# EAGLE design elric20-01A (EAGLE 9.5.2)
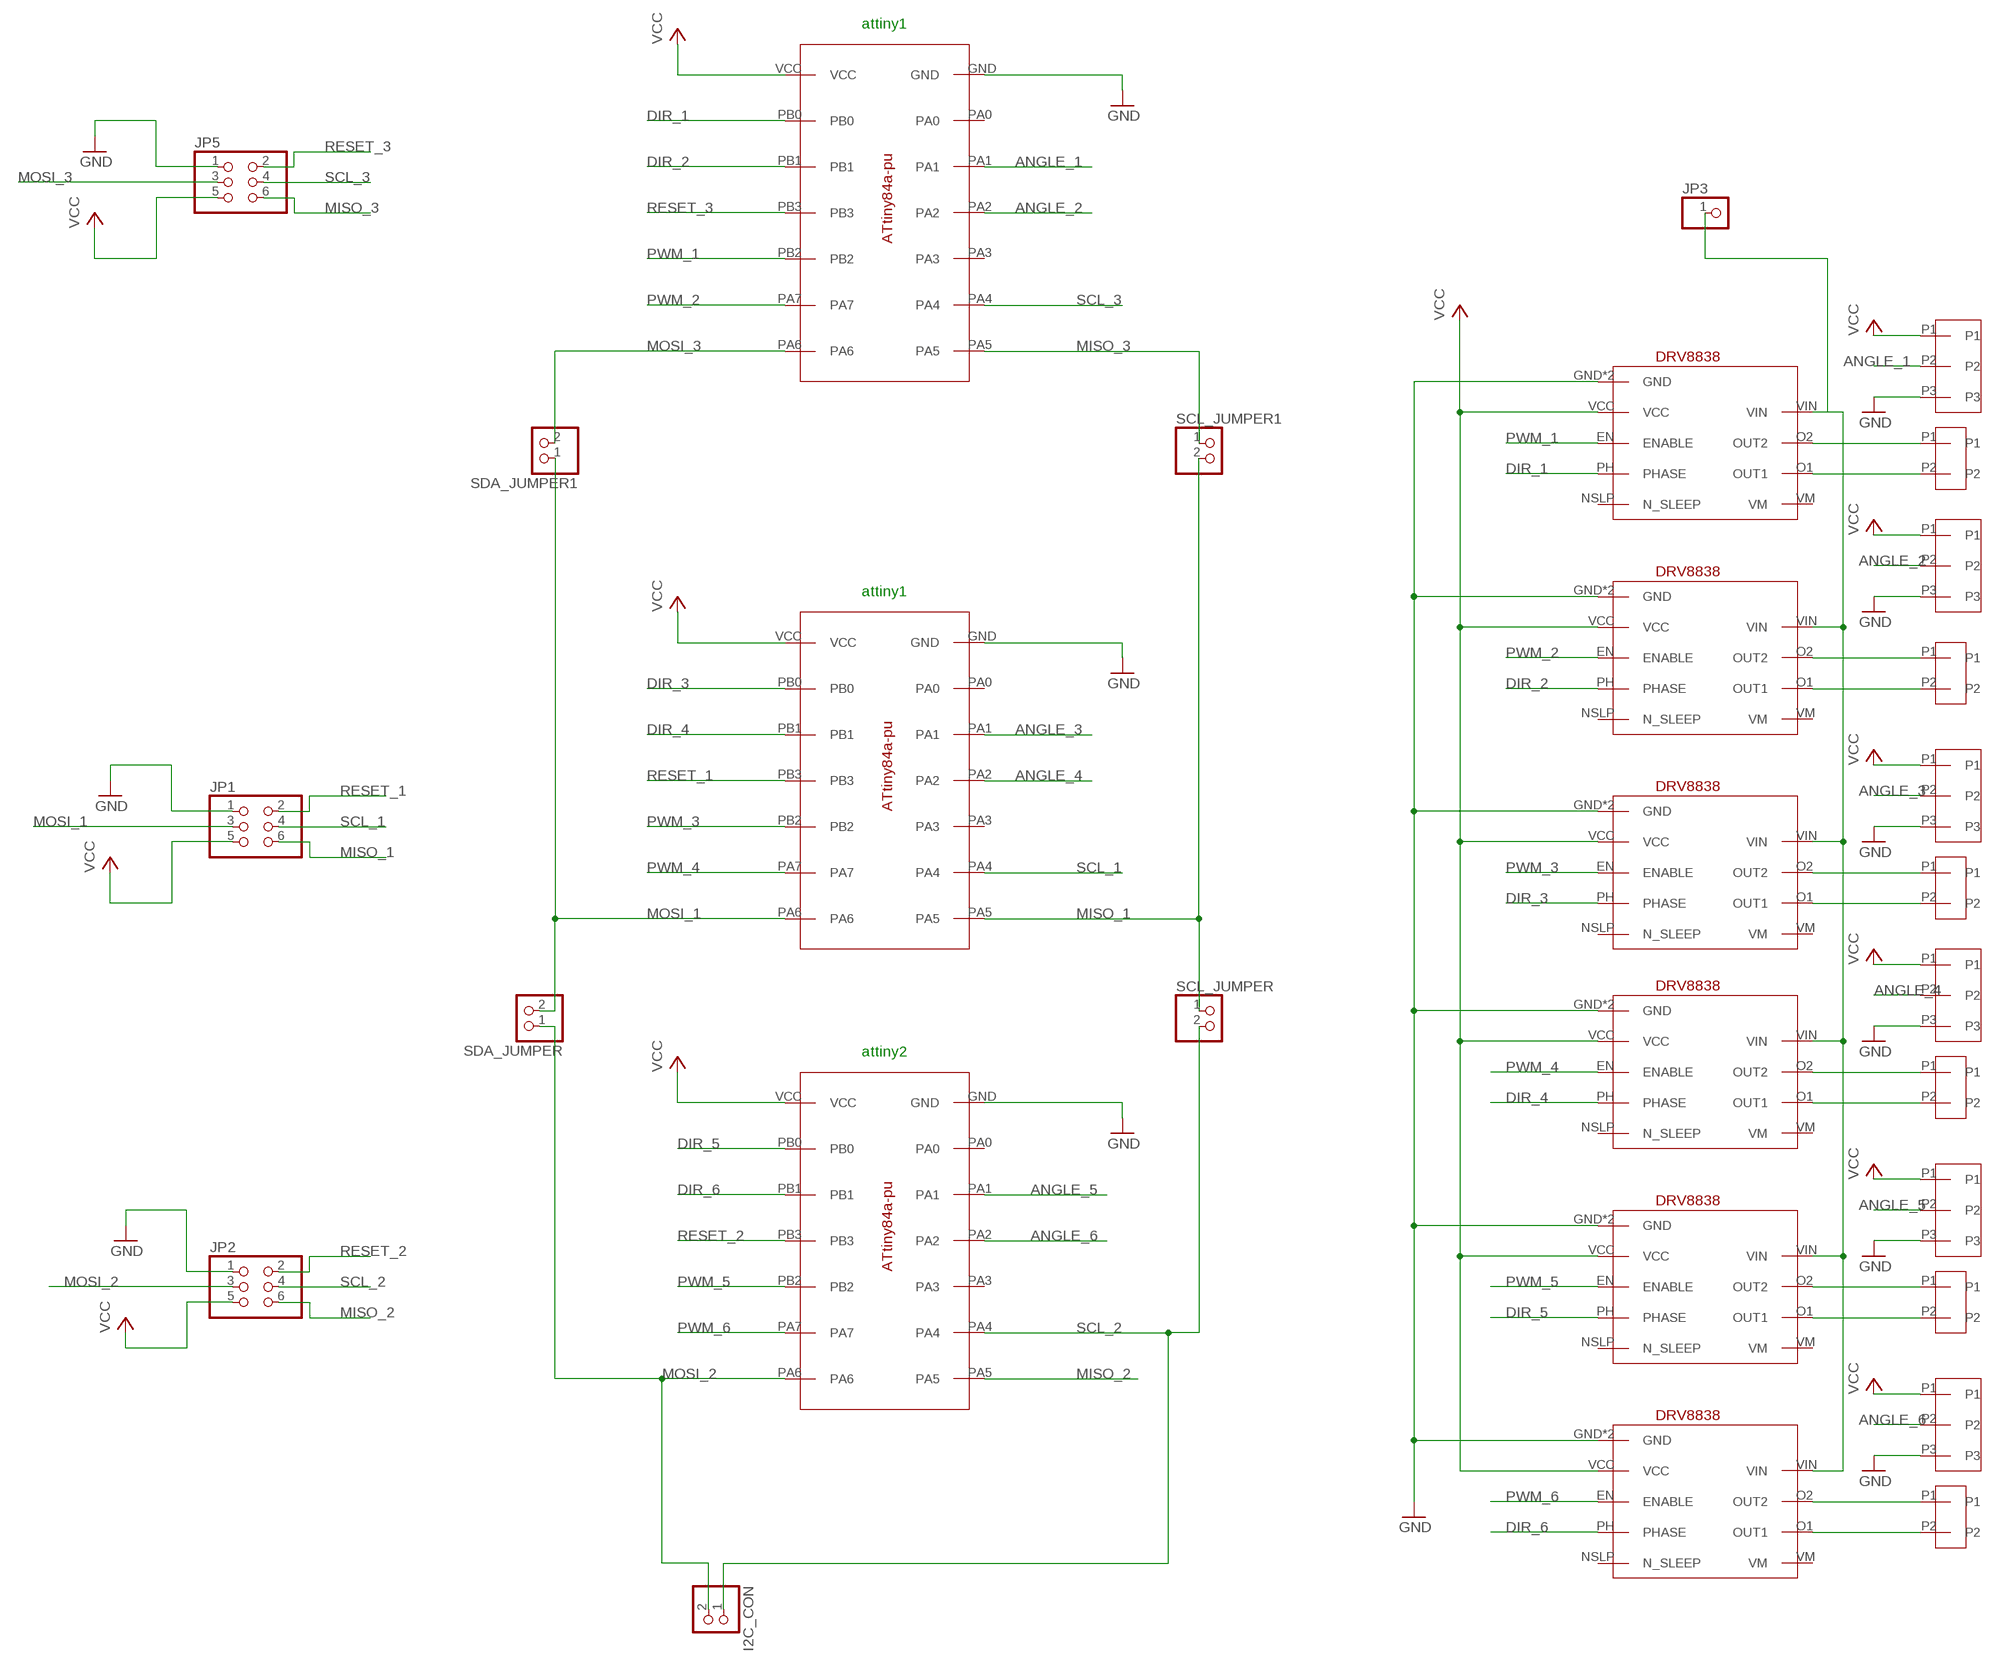
[diagram p0: schematic, sheet 1]

## Parts
I2C_CON  PINHD-1X2  [1X02]
JP1  PINHD-2X3  [2X03]
JP2  PINHD-2X3  [2X03]
JP3  PINHD-1X1  [1X01]
JP5  PINHD-2X3  [2X03]
SCL_JUMPER  PINHD-1X2  [1X02]
SCL_JUMPER1  PINHD-1X2  [1X02]
SDA_JUMPER  PINHD-1X2  [1X02]
SDA_JUMPER1  PINHD-1X2  [1X02]
U$1  ATTINY84A-PU  [ATTINY84A-PU]
U$2  DRV8838  [DRV8838]
U$3  DRV8838  [DRV8838]
U$4  DRV8838  [DRV8838]
U$5  DRV8838  [DRV8838]
U$6  DRV8838  [DRV8838]
U$7  DRV8838  [DRV8838]
U$8  ATTINY84A-PU  [ATTINY84A-PU]
U$9  PAD_SMD_X2_BIG  [PAD_SMD_X2_BIG]
U$10  PAD_SMD_X2_BIG  [PAD_SMD_X2_BIG]
U$11  PAD_SMD_X2_BIG  [PAD_SMD_X2_BIG]
U$12  PAD_SMD_X2_BIG  [PAD_SMD_X2_BIG]
U$13  PAD_SMD_X2_BIG  [PAD_SMD_X2_BIG]
U$14  PAD_SMD_X2_BIG  [PAD_SMD_X2_BIG]
U$15  PAD_SMD_X3  [PAD_SMD_X3]
U$16  PAD_SMD_X3  [PAD_SMD_X3]
U$17  PAD_SMD_X3  [PAD_SMD_X3]
U$18  PAD_SMD_X3  [PAD_SMD_X3]
U$19  PAD_SMD_X3  [PAD_SMD_X3]
U$20  PAD_SMD_X3  [PAD_SMD_X3]
U$21  ATTINY84A-PU  [ATTINY84A-PU]

## Nets
ANGLE_1: U$20.P2 U$21.PA1
ANGLE_2: U$19.P2 U$21.PA2
ANGLE_3: U$8.PA1 U$18.P2
ANGLE_4: U$8.PA2 U$17.P2
ANGLE_5: U$1.PA1 U$16.P2
ANGLE_6: U$1.PA2 U$15.P2
DIR_1: U$2.PH(PHASE) U$21.PB0
DIR_2: U$3.PH(PHASE) U$21.PB1
DIR_3: U$4.PH(PHASE) U$8.PB0
DIR_4: U$5.PH(PHASE) U$8.PB1
DIR_5: U$1.PB0 U$6.PH(PHASE)
DIR_6: U$1.PB1 U$7.PH(PHASE)
GND: JP1.1 JP2.1 JP5.1 U$1.GND U$2.GND U$2.GND2(GND) U$3.GND U$3.GND2(GND) U$4.GND U$4.GND2(GND) U$5.GND U$5.GND2(GND) U$6.GND U$6.GND2(GND) U$7.GND U$7.GND2(GND) U$8.GND U$15.P3 U$16.P3 U$17.P3 U$18.P3 U$19.P3 U$20.P3 U$21.GND
MISO_1: JP1.6 SCL_JUMPER1.2 SCL_JUMPER.1 U$8.PA5
MISO_2: JP2.6 U$1.PA5
MISO_3: JP5.6 SCL_JUMPER1.1 U$21.PA5
MOSI_1: JP1.3 SDA_JUMPER1.1 SDA_JUMPER.2 U$8.PA6
MOSI_2: I2C_CON.2 JP2.3 SDA_JUMPER.1 U$1.PA6
MOSI_3: JP5.3 SDA_JUMPER1.2 U$21.PA6
N$1: U$2.O2(OUT2) U$9.P1
N$2: U$2.O1(OUT1) U$9.P2
N$3: U$3.O2(OUT2) U$10.P1
N$4: U$3.O1(OUT1) U$10.P2
N$5: U$4.O2(OUT2) U$11.P1
N$6: U$4.O1(OUT1) U$11.P2
N$7: U$5.O2(OUT2) U$12.P1
N$8: U$5.O1(OUT1) U$12.P2
N$9: U$6.O2(OUT2) U$13.P1
N$10: U$6.O1(OUT1) U$13.P2
N$11: U$7.O2(OUT2) U$14.P1
N$12: U$7.O1(OUT1) U$14.P2
N$13: JP3.1 U$2.VIN U$3.VIN U$4.VIN U$5.VIN U$6.VIN U$7.VIN
PWM_1: U$2.EN(ENABLE) U$21.PB2
PWM_2: U$3.EN(ENABLE) U$21.PA7
PWM_3: U$4.EN(ENABLE) U$8.PB2
PWM_4: U$5.EN(ENABLE) U$8.PA7
PWM_5: U$1.PB2 U$6.EN(ENABLE)
PWM_6: U$1.PA7 U$7.EN(ENABLE)
RESET_1: JP1.2 U$8.PB3
RESET_2: JP2.2 U$1.PB3
RESET_3: JP5.2 U$21.PB3
SCL_1: JP1.4 U$8.PA4
SCL_2: I2C_CON.1 JP2.4 SCL_JUMPER.2 U$1.PA4
SCL_3: JP5.4 U$21.PA4
VCC: JP1.5 JP2.5 JP5.5 U$1.VCC U$2.VCC U$3.VCC U$4.VCC U$5.VCC U$6.VCC U$7.VCC U$8.VCC U$15.P1 U$16.P1 U$17.P1 U$18.P1 U$19.P1 U$20.P1 U$21.VCC
Unconnected: U$1.PA0 U$1.PA3 U$2.NSLP(N_SLEEP) U$2.VM U$3.NSLP(N_SLEEP) U$3.VM U$4.NSLP(N_SLEEP) U$4.VM U$5.NSLP(N_SLEEP) U$5.VM U$6.NSLP(N_SLEEP) U$6.VM U$7.NSLP(N_SLEEP) U$7.VM U$8.PA0 U$8.PA3 U$21.PA0 U$21.PA3

## Notes on the sheet
- attiny1
- attiny1
- attiny2

## Library data of the parts
I2C_CON SCL_JUMPER SCL_JUMPER1 SDA_JUMPER SDA_JUMPER1 = pinhead:PINHD-1X2: PIN HEADER
JP1 JP2 JP5 = pinhead:PINHD-2X3: PIN HEADER
JP3 = pinhead:PINHD-1X1: PIN HEADER
U$1 U$8 U$21 = elric:ATTINY84A-PU
U$2-U$7 = elric:DRV8838
U$9-U$14 = elric:PAD_SMD_X2_BIG
U$15-U$20 = elric:PAD_SMD_X3

## Board
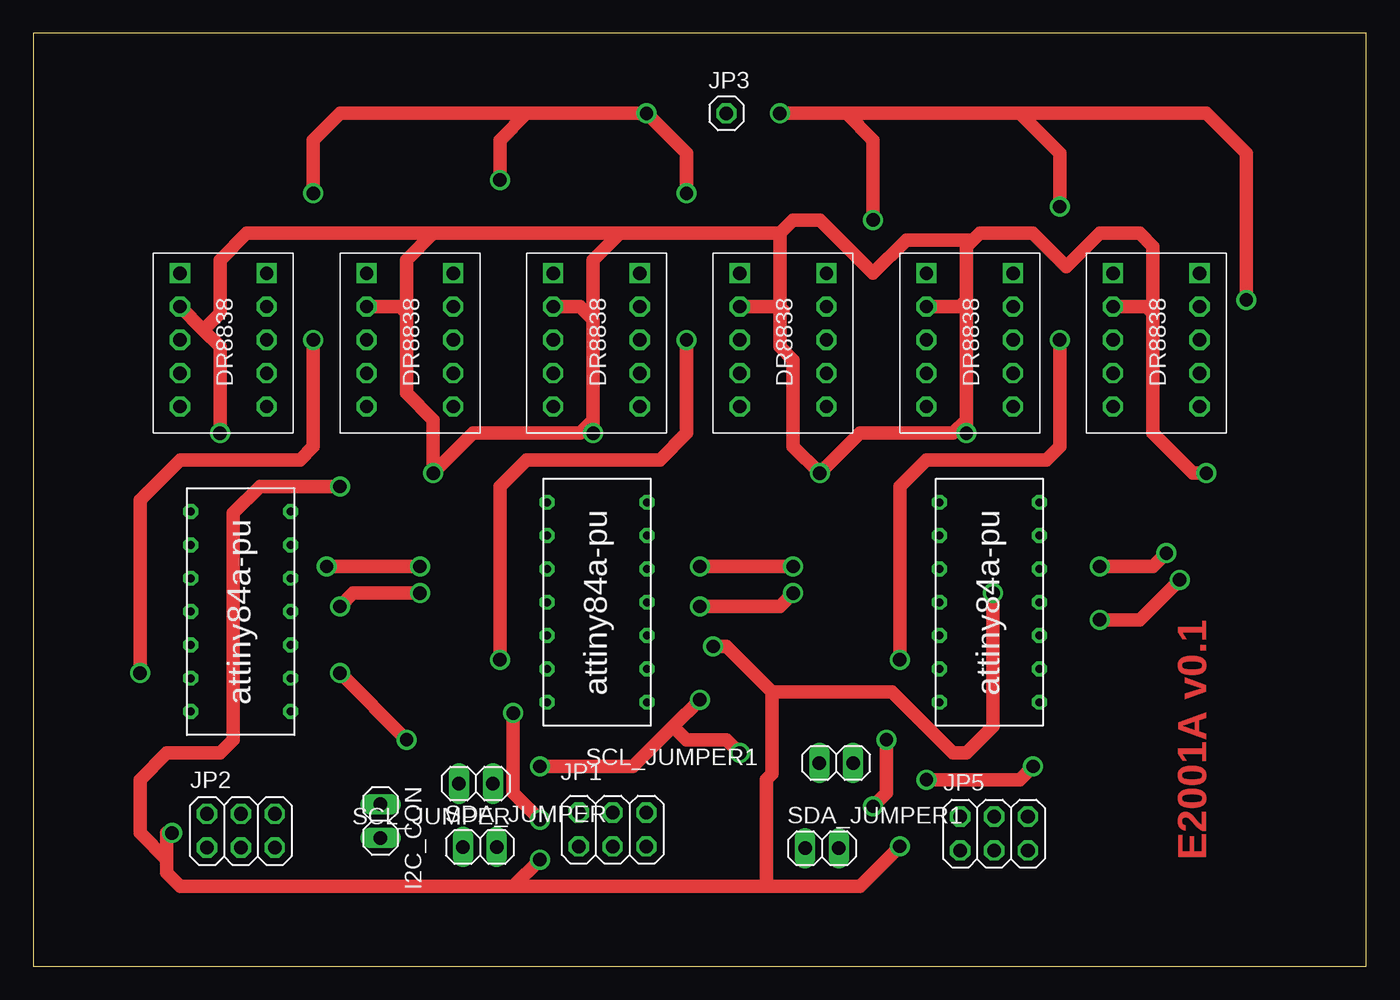
[diagram p1: board, top side]
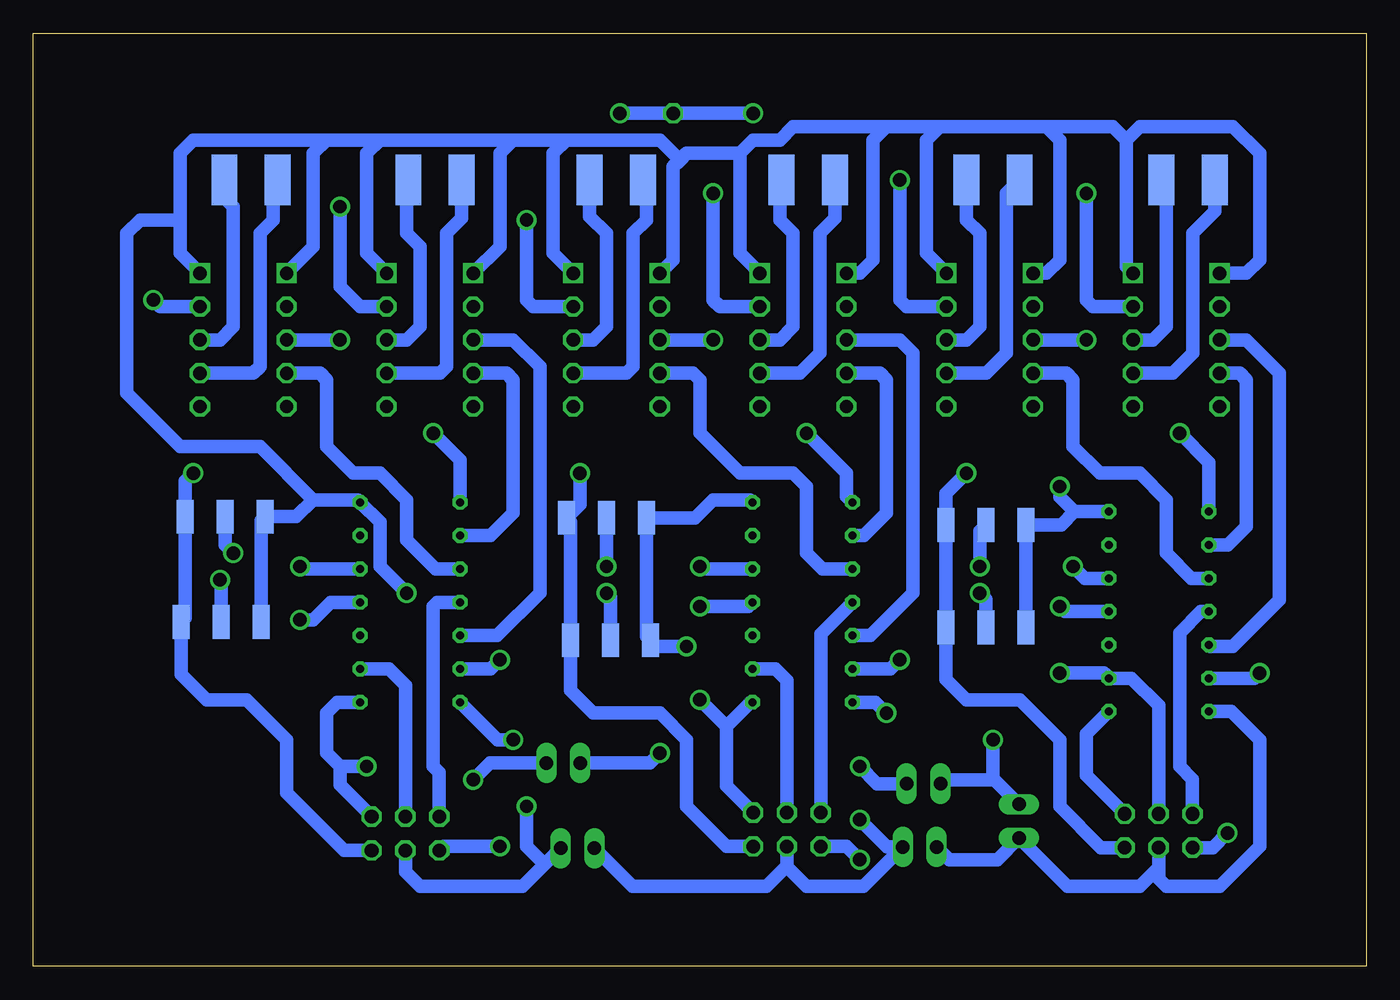
[diagram p2: board, bottom side, seen from below]

Size 100 x 70 mm. Coordinates in mm from the lower left corner, seen from the top.
Outline: 0,0 100,0 100,70 0,70 0,0
Copper layers (1*16): Top 0.035mm / dielectric 1.5mm / Bottom 0.035mm
Design rules "default": minimum track width 6mil, minimum drill 0.35mm, track to track 6mil, track to pad 6mil, pad to pad 6mil, via to via 6mil, smd to smd 6mil, copper to edge 40mil, drill to drill 6mil, minimum pad ring 10mil, minimum via ring 8mil, stop-mask expansion 4mil, vias tented up to drill 0mil, thermal gap 10mil

### Footprints (pad centres in the part's own frame; a part is rotated, then mirrored left to right if it is on the bottom)
1X02 = drill 1.016 long: 1 -1.27,0; 2 1.27,0
2X03 = drill 1.016 octagon: 1 -2.54,-1.27; 2 -2.54,1.27; 3 0,-1.27; 4 0,1.27; 5 2.54,-1.27; 6 2.54,1.27
1X01 = drill 1.016 octagon: 1 0,0
ATTINY84A-PU = drill 0.6 octagon: GND 7.5,0; PA0 7.5,-2.5; PA1 7.5,-5; PA2 7.5,-7.5; PA3 7.5,-10; PA4 7.5,-12.5; PA5 7.5,-15; PA6 0,-15; PA7 0,-12.5; PB0 0,-2.5; PB1 0,-5; PB2 0,-10; PB3 0,-7.5; VCC 0,0
DRV8838 = drill 1 octagon: EN 0,-5; NSLP 0,-10; O1 6.5,-7.5; O2 6.5,-5; PH 0,-7.5; VCC 0,-2.5; VIN 6.5,-2.5; VM 6.5,-10 | drill 1 square: GND 0,0; GND2 6.5,0
PAD_SMD_X2_BIG = smd 3.81 x 1.93: P1 0,4; P2 0,0
PAD_SMD_X3 = smd 2.54 x 1.27: P1 0,3; P2 0,0; P3 0,-3

### Placement (x,y rotation side)
I2C_CON  26.05,10.89 270 top
JP1  43.46,10.26 0 top
JP2  15.57,10.16 0 top
JP3  52,64 0 top
JP5  72.08,9.96 0 top
SCL_JUMPER  33.21,13.7 180 top
SCL_JUMPER1  60.24,15.25 180 top
SDA_JUMPER  33.5,8.95 0 top
SDA_JUMPER1  59.17,8.85 0 top
U$1  11.81,34.11 0 top
U$2  67,52 0 top
U$3  81,52 0 top
U$4  39,52 0 top
U$5  53,52 0 top
U$6  11,52 0 top
U$7  25,52 0 top
U$8  38.55,34.81 0 top
U$9  67.86,59 90 bottom
U$10  81.66,59 90 bottom
U$11  39.86,59 90 bottom
U$12  54.26,59 90 bottom
U$13  11.36,59 90 bottom
U$14  26,59 90 bottom
U$15  28.53,25.43 90 bottom
U$16  28.53,33.12 90 bottom
U$17  56.7,24.46 90 bottom
U$18  57,33.65 90 bottom
U$19  85.9,25.84 90 bottom
U$20  85.6,33.73 90 bottom
U$21  67.99,34.81 0 top

### Tracks (layer width: path | path; a pad name or v marks a point on that pad's centre or on a via)
ANGLE_1  (via drill 1)
  Top 1.016: v85,31 84,30 v80,30
  Bottom 1.016: U$20.P2 85.6,31.6 v85,31 | v80,30 79.81,29.81 U$21.PA1
ANGLE_2  (via drill 1)
  Top 1.016: v86,29 83,26 v80,26
  Bottom 1.016: U$19.P2 85.9,28.9 v86,29 | v80,26 79,26 77.69,27.31 U$21.PA2
ANGLE_3  (via drill 1)
  Top 1.016: v57,30 v50,30
  Bottom 1.016: U$18.P2 v57,30 | v50,30 49.81,29.81 U$8.PA1
ANGLE_4  (via drill 1)
  Top 1.016: v57,28 56,27 v50,27
  Bottom 1.016: U$17.P2 56.7,27.7 v57,28 | v50,27 46.36,27 U$8.PA2
ANGLE_5  (via drill 1)
  Top 1.016: v29,30 v22,30
  Bottom 1.016: U$16.P2 29,32.65 v29,30 | v22,30 21.11,29.11 U$1.PA1
ANGLE_6  (via drill 1)
  Top 1.016: v29,28 24,28 v23,27
  Bottom 1.016: U$15.P2 28.53,27.53 v29,28 | v23,27 22.61,26.61 U$1.PA2
DIR_1
  Bottom 1.016: U$2.PH 64.5,44.5 64,44 64,34 65.69,32.31 U$21.PB0
DIR_2
  Bottom 1.016: U$3.PH 78.5,44.5 78,44 78,39 76,37 74,37 72,35 72,32 69.81,29.81 U$21.PB1
DIR_3
  Bottom 1.016: U$4.PH 36.5,44.5 36,44 36,34 37.69,32.31 U$8.PB0
DIR_4
  Bottom 1.016: U$5.PH 50.5,44.5 50,44 50,40 47,37 43,37 42,36 42,31 40.81,29.81 U$8.PB1
DIR_5
  Bottom 1.016: U$6.PH 9.5,44.5 9,44 9,33 10.39,31.61 U$1.PB0
DIR_6
  Bottom 1.016: U$7.PH 22.5,44.5 22,44 22,39 20,37 17,37 15,35 15,31 13.11,29.11 U$1.PB1
GND  (via drill 1)
  Top 1.016: v38,8 36,6 | 36,6 11,6 10,7 10,8 | 10,8 10,10 v10.41,10 | 36,6 55,6 | 55,6 62,6 v65,9 | v51,24 52,24 55.41,20.59 | 55,6 55,14.01 55.41,14.42 55.41,20.59 | v23,36 17,36 15,34 15,17 14,16 10,16 8,14 8,10 10,8 | v72,28 72,18 70,16 69,16 64.41,20.59 55.41,20.59
  Bottom 1.016: JP1.1 38.99,8.99 v38,8 | v10.41,10 11.52,8.89 JP2.1 | v65,9 69.23,9 JP5.1 | U$8.GND 46.24,35 49,35 50.35,33.65 U$18.P3 54,24.76 U$17.P3 53.24,24 v51,24 | U$19.P3 82.9,33.43 U$20.P3 80.27,33.73 79,35 | 79,35 75.68,35 U$21.GND 74,33.32 74,30 v72,28 | U$15.P3 U$16.P3 22.88,33.12 21.89,34.11 | U$1.GND 21.89,34.11 | U$6.GND 9,52 8,53 8,61 10,63 17,63 18,62 | 18,62 18,52.5 U$6.GND2 | 18,62 19,63 24,63 | 24,63 32,63 | 32,63 33,62 33,53.5 U$7.GND2 | U$7.GND 24,52 23,53 23,62 24,63 | 32,63 36,63 | 36,63 37,62 37,53 38,52 U$4.GND | 36,63 43,63 44,62 46,62 47,61 | 47,61 47,53.5 U$4.GND2 | 47,61 51,61 51.5,60.5 | 51.5,60.5 52,60 52,53 U$5.GND | 51.5,60.5 53,62 60,62 | 60,62 61,61 61,53.5 U$5.GND2 | U$2.GND 65,54 65,61 64,62 | 64,62 60,62 | 64,62 74,62 | 74,62 75,61 75,53.5 U$2.GND2 | U$3.GND 79,54 79,61 78,62 | 78,62 74,62 | 78,62 88,62 89,61 89,56 | 89,56 89,53.5 U$3.GND2 | 21.89,34.11 23,35.22 v23,36 | 89,56 92,56 93,55 93,43 89,39 83,39 79,35
MISO_1  (via drill 1)
  Top 1.016: v38,15 45,15 48,18 | 48,18 v50,20 | v53,16 52,17 49,17 48,18
  Bottom 1.016: JP1.6 48,13.53 48,18 | 48,18 46.19,19.81 U$8.PA5 | SCL_JUMPER.1 36.7,13.7 v38,15 | v50,20 48,18 | SCL_JUMPER1.2 53.75,15.25 v53,16
MISO_2
  Bottom 1.016: JP2.6 21,14.32 21,17.42 U$1.PA5
MISO_3  (via drill 1)
  Top 1.016: v75,15 74,14 v67,14
  Bottom 1.016: JP5.6 77,13.61 77,15 | v67,14 65.75,15.25 SCL_JUMPER1.1 | 77,15 v75,15 | U$21.PA5 77.19,19.81 78,19 78,16 77,15
MOSI_1  (via drill 1)
  Top 1.016: v38,11 36,13 v36,19
  Bottom 1.016: v38,11 35.95,8.95 SDA_JUMPER.2 37.72,6 42,6 43.46,7.46 JP1.3 43.46,7.54 45,6 55.05,6 SDA_JUMPER1.1 | v36,19 36.81,19.81 U$8.PA6
MOSI_2
  Bottom 1.016: U$1.PA6 10.11,19.11 8,17 8,9 11,6 15,6 15.57,6.57 JP2.3 15.57,7.43 17,6 22.43,6 I2C_CON.2 27.67,8 31.28,8 SDA_JUMPER.1
MOSI_3  (via drill 1)
  Top 1.016: v64,17 64,13 v63,12
  Bottom 1.016: JP5.3 72.08,7.08 71,6 63.29,6 61.65,7.64 | 61.65,7.64 SDA_JUMPER1.2 | U$21.PA6 65.18,17 v64,17 | v63,12 63,9 61.65,7.64
N$1
  Bottom 1.016: U$2.O2 72,47 71,48 71,54 72,55 72,58.86 U$9.P1
N$2
  Bottom 1.016: U$2.O1 69.5,44.5 69,45 69,55 67.86,56.14 U$9.P2
N$3
  Bottom 1.016: U$3.O2 86,47 85,48 85,57 86,58 86,58.66 U$10.P1
N$4
  Bottom 1.016: U$3.O1 83.5,44.5 83,45 83,55 82,56 82,58.66 U$10.P2
N$5
  Bottom 1.016: U$4.O2 44,47 43,48 43,55 44,56 44,58.86 U$11.P1
N$6
  Bottom 1.016: U$4.O1 42.5,44.5 41,46 41,55 39.86,56.14 U$11.P2
N$7
  Bottom 1.016: U$5.O2 58,47 57,48 57,55 58.26,56.26 U$12.P1
N$8
  Bottom 1.016: U$5.O1 55.5,44.5 55,45 55,55 54,56 54,58.74 U$12.P2
N$9
  Bottom 1.016: U$6.O2 16,47 15,48 15,58.64 U$13.P1
N$10
  Bottom 1.016: U$6.O1 14.5,44.5 13,46 13,55 11.36,56.64 U$13.P2
N$11
  Bottom 1.016: U$7.O2 30,47 29,48 29,55 30,56 U$14.P1
N$12
  Bottom 1.016: U$7.O1 28.5,44.5 27,46 27,58 U$14.P2
N$13  (via drill 1)
  Top 1.016: v63,56 63,62 61,64 | 61,64 v56,64 | v77,57 77,61 74,64 | 74,64 61,64 | v91,50 91,61 88,64 74,64 | v49,58 49,61 v46,64 37,64 | v35,59 35,62 37,64 | v21,58 21,62 23,64 37,64
  Bottom 1.016: U$5.VIN 62.5,49.5 63,50 v63,56 | v56,64 JP3.1 v46,64 | U$2.VIN 75.5,49.5 77,51 v77,57 | U$3.VIN 90.5,49.5 v91,50 | U$4.VIN 48.5,49.5 49,50 v49,58 | U$7.VIN 34.5,49.5 35,50 v35,59 | U$6.VIN 20.5,49.5 21,50 v21,58
PWM_1
  Bottom 1.016: U$2.EN 64,47 62,45 62,28 65.19,24.81 U$21.PB2
PWM_2  (via drill 1)
  Top 1.016: v77,47 77,39 76,38 67,38 65,36 v65,23
  Bottom 1.016: U$3.EN v77,47 | U$21.PA7 65.69,22.31 v65,23
PWM_3
  Bottom 1.016: U$4.EN 35,47 34,46 34,28 37.19,24.81 U$8.PB2
PWM_4  (via drill 1)
  Top 1.016: v49,47 49,40 47,38 37,38 35,36 v35,23
  Bottom 1.016: U$5.EN v49,47 | U$8.PA7 35.69,22.31 v35,23
PWM_5
  Bottom 1.016: U$6.EN 9,47 6.52,44.52 6.52,27.48 10,24 11.7,24 U$1.PB2
PWM_6  (via drill 1)
  Top 1.016: v21,47 21,39 20,38 11,38 8,35 v8,22
  Bottom 1.016: U$7.EN v21,47 | U$1.PA7 8.39,21.61 v8,22
RESET_1
  Bottom 1.016: JP1.2 40.92,24.94 U$8.PB3
RESET_2
  Bottom 1.016: JP2.2 13.03,14.03 14,15 14,25 12.39,26.61 U$1.PB3
RESET_3
  Bottom 1.016: JP5.2 69.54,14.54 70,15 70,27 69.69,27.31 U$21.PB3
SCL_1
  Bottom 1.016: JP1.4 43.46,21.46 44.31,22.31 U$8.PA4
SCL_2  (via drill 1)
  Top 1.016: v23,22 v28,17
  Bottom 1.016: JP2.4 15.57,19.57 17.61,21.61 U$1.PA4 19.7,22 v23,22 | I2C_CON.1 27.89,14 | SCL_JUMPER.2 31.64,14 27.89,14 | v28,17 28,14.11 27.89,14
SCL_3
  Bottom 1.016: JP5.4 72.08,21.08 73.31,22.31 U$21.PA4
VCC  (via drill 1)
  Top 1.016: v14,40 14,46.5 12.75,47.75 | 12.75,47.75 U$6.VCC | v42,40 42,41 | 42,41 42,48.5 41.75,48.75 | 41.75,48.75 41,49.5 U$4.VCC | 70,50 69.5,49.5 U$2.VCC | v70,40 70,41 | 70,41 69,40 62,40 v59,37 57,39 57,45.5 56,46.5 56,55 | 42,41 41,40 33,40 v30,37 30,41 28,43 28,49 | v88,37 87,37 84,40 84,49 | 84,49 83.5,49.5 U$3.VCC | 56.25,49.25 56,49.5 U$5.VCC | 28,49 27.5,49.5 U$7.VCC | 70,41 70,50 | 70,50 70,54 70.5,54.5 | 70.5,54.5 71,55 75,55 77.5,52.5 80,55 83,55 84,54 84,49 | 56,55 57,56 59,56 63,52 65.5,54.5 70.5,54.5 | 41.75,48.75 42,49 42,53 44,55 | 44,55 56,55 | 28,49 28,53 30,55 | 30,55 44,55 | 12.75,47.75 14,49 14,53 16,55 30,55
  Bottom 1.016: JP2.5 19.89,8.89 23,12 23,17 26,20 30,20 31.53,21.53 U$15.P1 U$16.P1 31.53,35.47 v30,37 | JP1.5 48,9 51,12 51,17 53,19 58,19 59.7,20.7 U$17.P1 59.7,33.35 U$18.P1 59,34.65 v59,37 | JP5.5 76.69,8.69 81,13 81,17 84,20 87,20 88.9,21.9 U$19.P1 88.6,26.14 U$20.P1 88.6,36.4 v88,37 | U$1.VCC 11.81,37.81 v14,40 | U$8.VCC 39,35.26 39,37 v42,40 | U$21.VCC 67.99,37.99 v70,40

### Text on the board
Top: E2001A v0.1